# Altium schematic sheet 2P_JST-XH_EXT.SchDoc
size A4
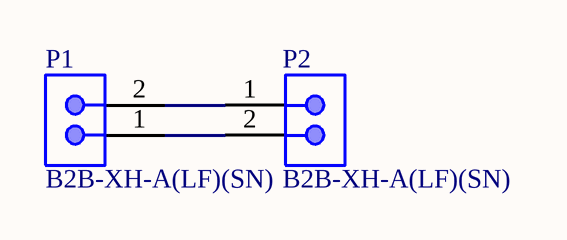
[diagram p0: 2P_JST-XH_EXT.SchDoc]

## Parts
P1  B2B-XH-A(LF)(SN)  [JST-B2B-XH-A_V]
P2  B2B-XH-A(LF)(SN)  [JST-B2B-XH-A_V]

## Nets
NetP1_1: P1.1 P2.2
NetP1_2: P1.2 P2.1

## Library data of the parts
P1 P2 = CMP-2000-05888-1: Male Header, Pitch 2.5 mm, 1 x 2 Position, Height 7 mm, Tail Length 3.4 mm, -25 to 85 degC, RoHS, Bulk; Manufacturer: JST; No of Positions: 2; Pitch: 2.5mm; Style/Orientation: StraightHeader/Plug; Datasheet Version: 05/2016; Package Description: Male Header, Pitch 2.5 mm, 1 x 2 Position, Height 7 mm, Tail Length 3.4 mm; Package Reference: B2B-XH-A; Mounting Technology: ThroughHole; Type: ShroudedHeader; Datasheet URL: http://www.jst-mfg.com/product/pdf/eng/eXH.pdf; Manufacturer URL: http://www.jst.com/home2.html; Termination: Crimp